# EAGLE design Grove_LED (EAGLE 6.1)
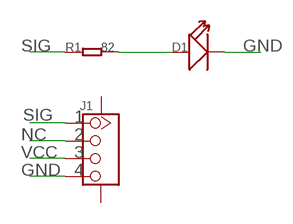
[diagram p0: schematic, sheet 1]

## Parts
D1  LED-3MM  [LED-2P-2.54-3MM]
J1  TWIG-4P-2.0-SMD-FEMALE-REINFORCE'90D'  [4P-SMD-2.0-90D]
R1  82  R-1206  [1206]

## Nets
GND: D1.K(-) J1.4
N$1: D1.A(+) R1.2
NC: J1.2
SIG: J1.1 R1.1
VCC: J1.3
Unconnected: J1.SS1 J1.SS2

## Notes on the sheet
- SIG | GND
- SIG | 1
- NC | 2
- VCC | 3
- GND | 4

## Library data of the parts
D1 = Discrete:LED*
J1 = Connector4pin-dip:TWIG-4P-2.0-SMD-FEMALE-REINFORCE
R1 = Discrete:R*

## Board
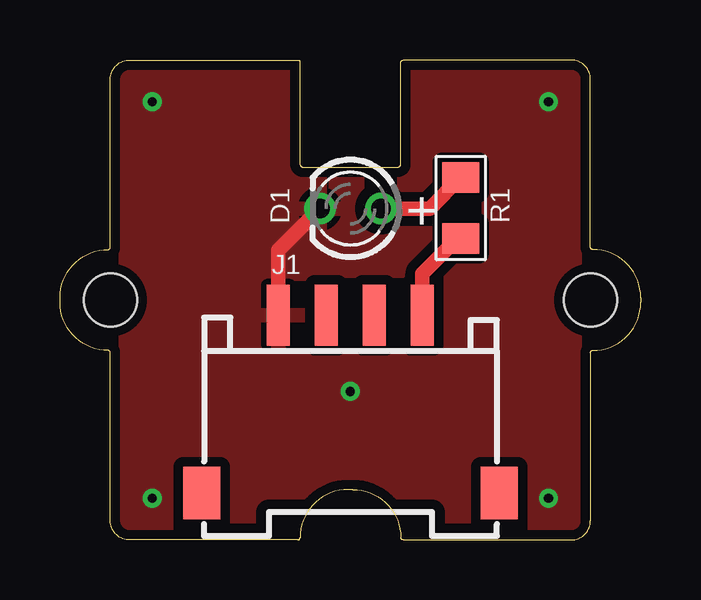
[diagram p1: board, top side]
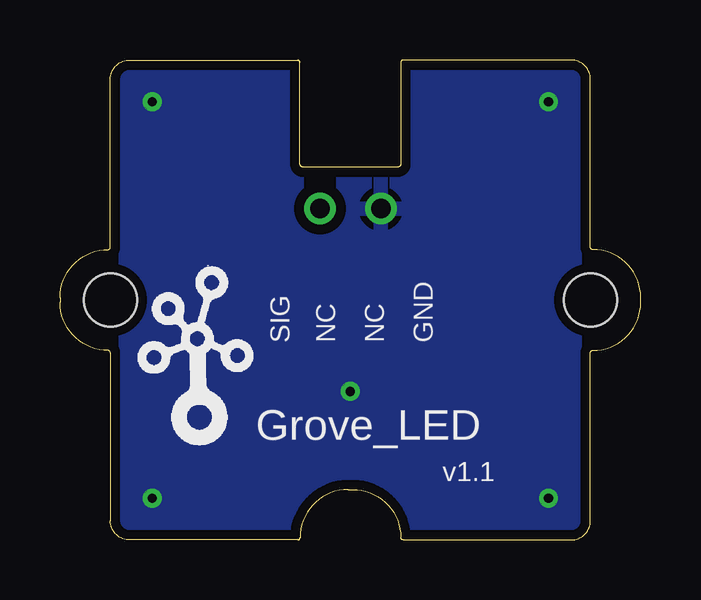
[diagram p2: board, bottom side, seen from below]

Size 24.2 x 20 mm. Coordinates in mm from the lower left corner, seen from the top.
Copper layers (1*16): Top 0.035mm / dielectric 1.5mm / Bottom 0.035mm
Design rules: minimum track width 10mil, minimum drill 12mil, track to track 8mil, track to pad 8mil, pad to pad 8mil, via to via 8mil, smd to smd 8mil, copper to edge 10mil, drill to drill 8mil, minimum pad ring 10mil, minimum via ring 8mil, stop-mask expansion 4mil, vias tented up to drill 100mil, thermal gap 10mil

### Footprints (pad centres in the part's own frame; a part is rotated, then mirrored left to right if it is on the bottom)
LED-2P-2.54-3MM = drill 0.813: A -1.27,0; K 1.27,0
4P-SMD-2.0-90D = smd 0.965 x 2.54: 1 -3,0; 2 -1,0; 3 1,0; 4 3,0 | smd 1.55 x 2.184: SS1 -6.2,7.4; SS2 6.2,7.4
1206 = smd 1.27 x 1.524: 1 -1.27,0; 2 1.27,0
1U-DIM = hole 2.2: 0,-10; 0,10

### Placement (x,y rotation side)
D1  12.1,13.81 180 top
J1  12.1,9.36 180 top
R1  16.7,13.84 90 top
U$1  [1U-DIM]  12.1,10 90 top
U$2  [TWIGLOGO]  18.45,4.92 0 bottom

### Tracks (layer width: path | path; a pad name or v marks a point on that pad's centre or on a via)
GND  (via drill 0.38)
  Top 0.61: J1.4 9.1,12.08 D1.K
  other vias: 3.85,18.25 20.36,18.25 12.1,6.19 20.36,1.74 3.85,1.74
  pour Top (isolate 0.406): 0.04,20.16 23.28,20.16 arc-90 24.16,19.91 24.16,-0.16 0.29,-0.16 arc-90 0.04,0.09
  pour Bottom (isolate 0.406): 0.04,20.16 23.28,20.16 arc-90 24.16,19.91 24.16,-0.16 0.29,-0.16 arc-90 0.04,0.09
N$1
  Top 0.61: D1.A 15.4,13.81 R1.2
SIG
  Top 0.61: J1.1 15.1,11.09 16.57,12.56 R1.1

### Text on the board
tPlace: +
bPlace: GND | NC | NC | SIG | Grove_LED | v1.1